# Altium project 遥控手柄PCB_v2.PrjPcb
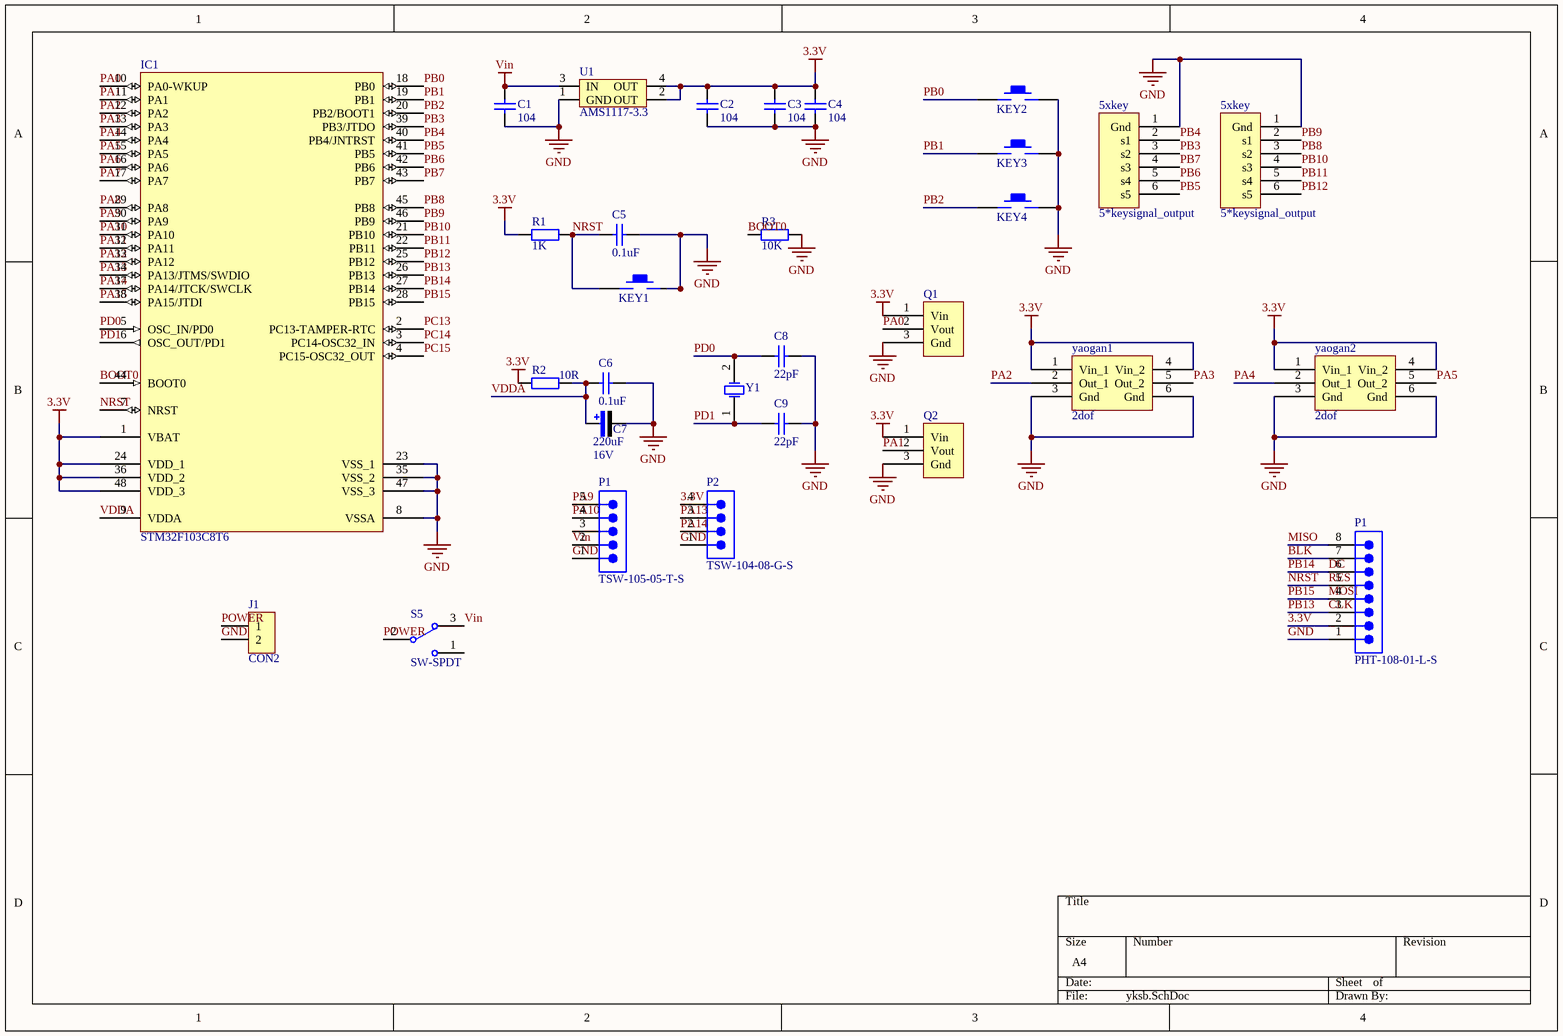
[diagram p0: yksb.SchDoc]
1 sheet, 30 parts. Net scope: global (net labels, ports and power ports of the same name join across sheets).
Board file: yksb.PcbDoc

## Sheet yksb.SchDoc
size A4

### Parts
(Parts that share a designator on the sheet are numbered #1, #2 ... from top to bottom, then left to right.)
5xkey#1  5*keysignal_output  [5xkey]
5xkey#2  5*keysignal_output  [5xkey]
C1  value 104  [C-RAD-0603]  (hidden comment: Cap)
C2  value 104  [C-RAD-0603]  (hidden comment: Cap)
C3  value 104  [C-RAD-0603]  (hidden comment: Cap)
C4  value 104  [C-RAD-0603]  (hidden comment: Cap)
C5  value 0.1uF  [C-RAD-0603]  (hidden comment: Cap)
C6  value 0.1uF  [C-RAD-0603]  (hidden comment: Cap)
C7  value 220uF  Vol: 16V  [C-RB-S6]  (hidden comment: Cap Pol)
C8  value 22pF  [C-RAD-0603]  (hidden comment: Cap)
C9  value 22pF  [C-RAD-0603]  (hidden comment: Cap)
IC1  STM32F103C8T6  [LQFP48_M]
J1  CON2  [DC-005]
KEY1  KEY_M  [KEY_M]  (value not drawn)
KEY2  KEY_M  [KEY_M]  (value not drawn)
KEY3  KEY_M  [KEY_M]  (value not drawn)
KEY4  KEY_M  [KEY_M]  (value not drawn)
P1#1  TSW-105-05-T-S  [SMTC-TSW-105-05-X-S]
P1#2  PHT-108-01-L-S  [SMTC-PHT-108-01-X-S]
P2  TSW-104-08-G-S  [SMTC-TSW-104-08-X-S]
Q1  (no value)  [dianweiqi]
Q2  (no value)  [dianweiqi]
R1  value 1K  [0603-1]  (hidden comment: Res1)
R2  value 10R  [0603-1]  (hidden comment: Res1)
R3  value 10K  [0603-1]  (hidden comment: Res1)
S5  SW-SPDT  [SWITCH_A2]
U1  AMS1117-3.3  [AMS1117]
Y1  XTAL  [XTAL_US]  (value not drawn)
yaogan1  2dof  [yaogan1]
yaogan2  2dof  [yaogan1]

### Nets
3.3V: C2.1 C3.1 C4.1 IC1.1(VBAT) IC1.24(VDD_1) IC1.36(VDD_2) IC1.48(VDD_3) P1#2.2 P2.4 Q1.1(Vin) Q2.1(Vin) R1.1 R2.1 U1.2(OUT) U1.4(OUT) yaogan1.1(Vin_1) yaogan1.4(Vin_2) yaogan2.1(Vin_1) yaogan2.4(Vin_2)
GND: 5xkey#1.1(Gnd) 5xkey#2.1(Gnd) C1.2 C2.2 C3.2 C4.2 C5.1 C6.1 C7.2 C8.2 C9.2 IC1.8(VSSA) IC1.23(VSS_1) IC1.35(VSS_2) IC1.47(VSS_3) J1.2 KEY1.2 KEY2.2 KEY3.2 KEY4.2 P1#1.1 P1#2.1 P2.1 Q1.3(Gnd) Q2.3(Gnd) R3.2 U1.1(GND) yaogan1.3(Gnd) yaogan1.6(Gnd) yaogan2.3(Gnd) yaogan2.6(Gnd)
Vin: C1.1 P1#1.2 S5.3 U1.3(IN)
BLK: P1#2.7
BOOT0: IC1.44(BOOT0) R3.1
CLK: IC1.26(PB13) P1#2.3  [also labelled PB13]
DC: IC1.27(PB14) P1#2.6  [also labelled PB14]
MISO: P1#2.8
MOSI: IC1.28(PB15) P1#2.4  [also labelled PB15]
NRST: C5.2 IC1.7(NRST) KEY1.1 P1#2.5 R1.2  [also labelled RES]
PA0: IC1.10(PA0-WKUP) Q1.2(Vout)
PA1: IC1.11(PA1) Q2.2(Vout)
PA2: IC1.12(PA2) yaogan1.2(Out_1)
PA3: IC1.13(PA3) yaogan1.5(Out_2)
PA4: IC1.14(PA4) yaogan2.2(Out_1)
PA5: IC1.15(PA5) yaogan2.5(Out_2)
PA6: IC1.16(PA6)
PA7: IC1.17(PA7)
PA8: IC1.29(PA8)
PA9: IC1.30(PA9) P1#1.5
PA10: IC1.31(PA10) P1#1.4
PA11: IC1.32(PA11)
PA12: IC1.33(PA12)
PA13: IC1.34(PA13/JTMS/SWDIO) P2.3
PA14: IC1.37(PA14/JTCK/SWCLK) P2.2
PA15: IC1.38(PA15/JTDI)
PB0: IC1.18(PB0) KEY2.1
PB1: IC1.19(PB1) KEY3.1
PB2: IC1.20(PB2/BOOT1) KEY4.1
PB3: 5xkey#1.3(s2) IC1.39(PB3/JTDO)
PB4: 5xkey#1.2(s1) IC1.40(PB4/JNTRST)
PB5: 5xkey#1.6(s5) IC1.41(PB5)
PB6: 5xkey#1.5(s4) IC1.42(PB6)
PB7: 5xkey#1.4(s3) IC1.43(PB7)
PB8: 5xkey#2.3(s2) IC1.45(PB8)
PB9: 5xkey#2.2(s1) IC1.46(PB9)
PB10: 5xkey#2.4(s3) IC1.21(PB10)
PB11: 5xkey#2.5(s4) IC1.22(PB11)
PB12: 5xkey#2.6(s5) IC1.25(PB12)
PC13: IC1.2(PC13-TAMPER-RTC)
PC14: IC1.3(PC14-OSC32_IN)
PC15: IC1.4(PC15-OSC32_OUT)
PD0: C8.1 IC1.5(OSC_IN/PD0) Y1.2(OSC2)
PD1: C9.1 IC1.6(OSC_OUT/PD1) Y1.1(OSC1)
POWER: J1.1 S5.2
VDDA: C6.2 C7.1 IC1.9(VDDA) R2.2

Not connected (* = marked no-connect by the designer): P1#1 3; S5 1

### Library data of the parts
5xkey#1 5xkey#2 = 5xkey: pin to pad: 1>3 3>1
C1-C6 C8 C9 = Cap: 无极性电容; Published: 8-Jun-2000; LatestRevisionDate: 17-Jul-2002; LatestRevisionNote: Re-released for DXP Platform.; PackageReference: RAD-0.3; Publisher: Altium Limited
C7 = Cap Pol: 极性电解电容; Published: 8-Jun-2000; LatestRevisionDate: 17-Jul-2002; LatestRevisionNote: Re-released for DXP Platform.; PackageReference: RB7.6-15; Publisher: Altium Limited
IC1 = STM32F103C8T6: 单片机; Published: 30-May-2008; DatasheetVersion: rev6, Mar-2008; PackageVersion: Mar-2008; PackageReference: LQFP48; Publisher: Altium Limited; PackageDescription: 48-Pin Low-Profile Quad Flat Pack, 7 x 7 mm Body, 0.5 mm Pitch (LQFP48); ComponentLink1Description: Manufacturer Link; ComponentLink1URL: www.st.com/stm32; ComponentLink2Description: Datasheet; ComponentLink2URL: http://www.st.com/stonline/products/literature/ds/13587.pdf
J1 = CON2: 连接器
P1#1 = TSW-105-05-T-S: 0.025" SQ Post Header, Through-hole, Vertical, -55 to 105 degC, 2.54 mm Pitch, 5-Pin, Male, RoHS; Manufacturer: Samtec; Pitch: 2.54 mm; DatasheetVersion: F-214; PackageVersion: DM, 8/1988; PackageReference: TSW-105-05-X-S; PackageDescription: .025[0.64] SQ. Post Terminal Strip Assembly; Supplier 1: Digi-Key; Supplier Part Number 1: SAM1019-05-ND; Orientation: Vertical; RoHS: True; Temperature Range: -55 to 105 degC; Mounting Technology: Through-hole; PartNumber: TSW-105-05-T-S; ComponentLink1Description: Manufacturer URL; ComponentLink1URL: http://www.samtec.com; ComponentLink2Description: Datasheet; ComponentLink2URL: http://www.samtec.com/documents/webfiles/pdf/TSW_TH.PDF; ComponentLink3Description: Package Specification; ComponentLink3URL: http://www.samtec.com/documents/webfiles/cpdf/TSW-XXX-XX-XXX-X-XX-XXX-MKT.pdf
P1#2 = PHT-108-01-L-S: Press Fit Header, Through-hole, Vertical, -55 to 125 degC, 2.54 mm Pitch, 8-Pin, Male, RoHS; Manufacturer: Samtec; Pitch: 2.54 mm; DatasheetVersion: F-214; PackageVersion: J, 9/2009; PackageReference: PHT-108-01-X-S; PackageDescription: .100 Press Fit Socket Assembly; Orientation: Vertical; RoHS: True; Temperature Range: -55 to 125 degC; Mounting Technology: Through-hole; PartNumber: PHT-108-01-L-S; ComponentLink1Description: Manufacturer URL; ComponentLink1URL: http://www.samtec.com; ComponentLink2Description: Datasheet; ComponentLink2URL: http://www.samtec.com/documents/webfiles/pdf/pht.pdf; ComponentLink3Description: Package Specification; ComponentLink3URL: http://www.samtec.com/documents/webfiles/cpdf/PHT-1XX-XX-X-X-XXX-MKT.pdf
P2 = TSW-104-08-G-S: 0.025" SQ Post Header, Through-hole, Vertical, -55 to 125 degC, 2.54 mm Pitch, 4-Pin, Male, RoHS; Manufacturer: Samtec; Pitch: 2.54 mm; DatasheetVersion: F-214; PackageVersion: DM, 8/1988; PackageReference: TSW-104-08-X-S; PackageDescription: .025[0.64] SQ. Post Terminal Strip Assembly; Supplier 1: Digi-Key; Supplier Part Number 1: SAM1038-04-ND; Orientation: Vertical; RoHS: True; Temperature Range: -55 to 125 degC; Mounting Technology: Through-hole; PartNumber: TSW-104-08-G-S; ComponentLink1Description: Manufacturer URL; ComponentLink1URL: http://www.samtec.com; ComponentLink2Description: Datasheet; ComponentLink2URL: http://www.samtec.com/documents/webfiles/pdf/TSW_TH.PDF; ComponentLink3Description: Package Specification; ComponentLink3URL: http://www.samtec.com/documents/webfiles/cpdf/TSW-XXX-XX-XXX-X-XX-XXX-MKT.pdf
Q1 Q2 = dianweiqi
R1-R3 = Res1: 贴片电阻; Published: 8-Jun-2000; LatestRevisionDate: 17-Jul-2002; LatestRevisionNote: Re-released for DXP Platform.; PackageReference: AXIAL-0.4; Publisher: Altium Limited
S5 = SW-SPDT: 开关; Published: 24-Mar-1999; LatestRevisionDate: 17-Dec-2003; LatestRevisionNote: Schematic revised, PCB Footprint replaced.; DatasheetDocument: 05-Dec-2000; PackageReference: TL36WW15050; Publisher: Altium Limited; ComponentLink1Description: Manufacturer Link; ComponentLink1URL: http://www.apem.com
U1 = AMS1117
Y1 = XTAL: Crystal Oscillator; Published: *; LatestRevisionDate: *; LatestRevisionNote: *; Publisher: *
yaogan1 yaogan2 = yaogan1